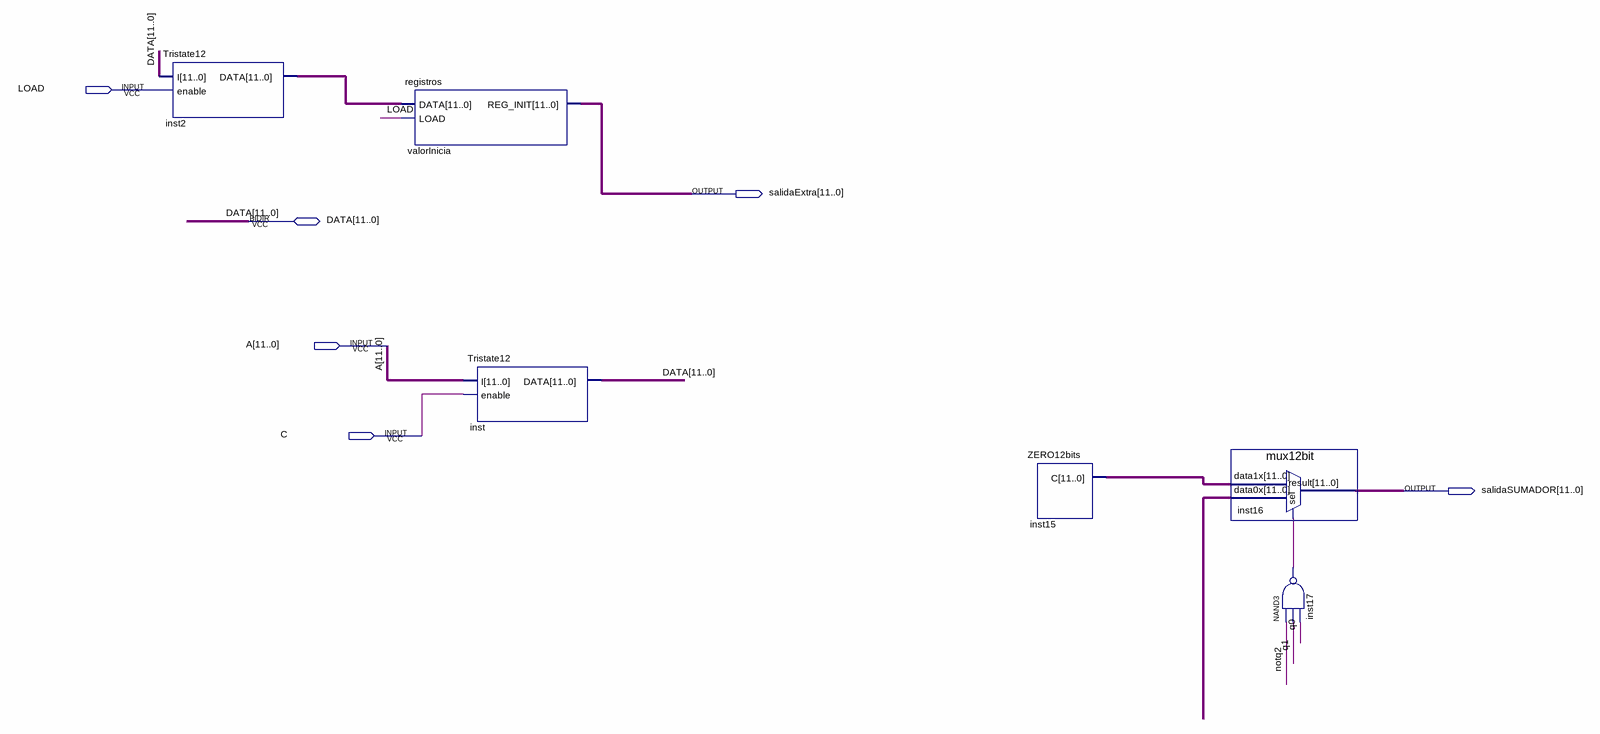
[diagram p0: schematic sheet]
// Quartus schematic PROBANDOTRISTORbdf.bdf as structural Verilog: 6 symbols, 6 pins
module PROBANDOTRISTORbdf (
  input  LOAD,
  input  [11:0] A,
  input  C,
  inout  [11:0] DATA,
  output [11:0] salidaExtra,
  output [11:0] salidaSUMADOR
);

  wire inst17_out, notq2, q0, q1;
  wire [11:0] inst2_data, inst15_c, undriven;

  Tristate12 inst2 (.I(DATA), .enable(LOAD), .DATA(inst2_data));
  registros valorInicia (.DATA(inst2_data), .LOAD(LOAD), .REG_INIT(salidaExtra));
  Tristate12 inst (.I(A), .enable(C), .DATA(DATA));
  ZERO12bits inst15 (.C(inst15_c));
  mux12bit inst16 (.data1x(inst15_c), .data0x(undriven), .sel(inst17_out), .result(salidaSUMADOR));
  nand inst17 (inst17_out, notq2, q1, q0);
endmodule
